# EAGLE design 7120 (EAGLE 8.3.1)
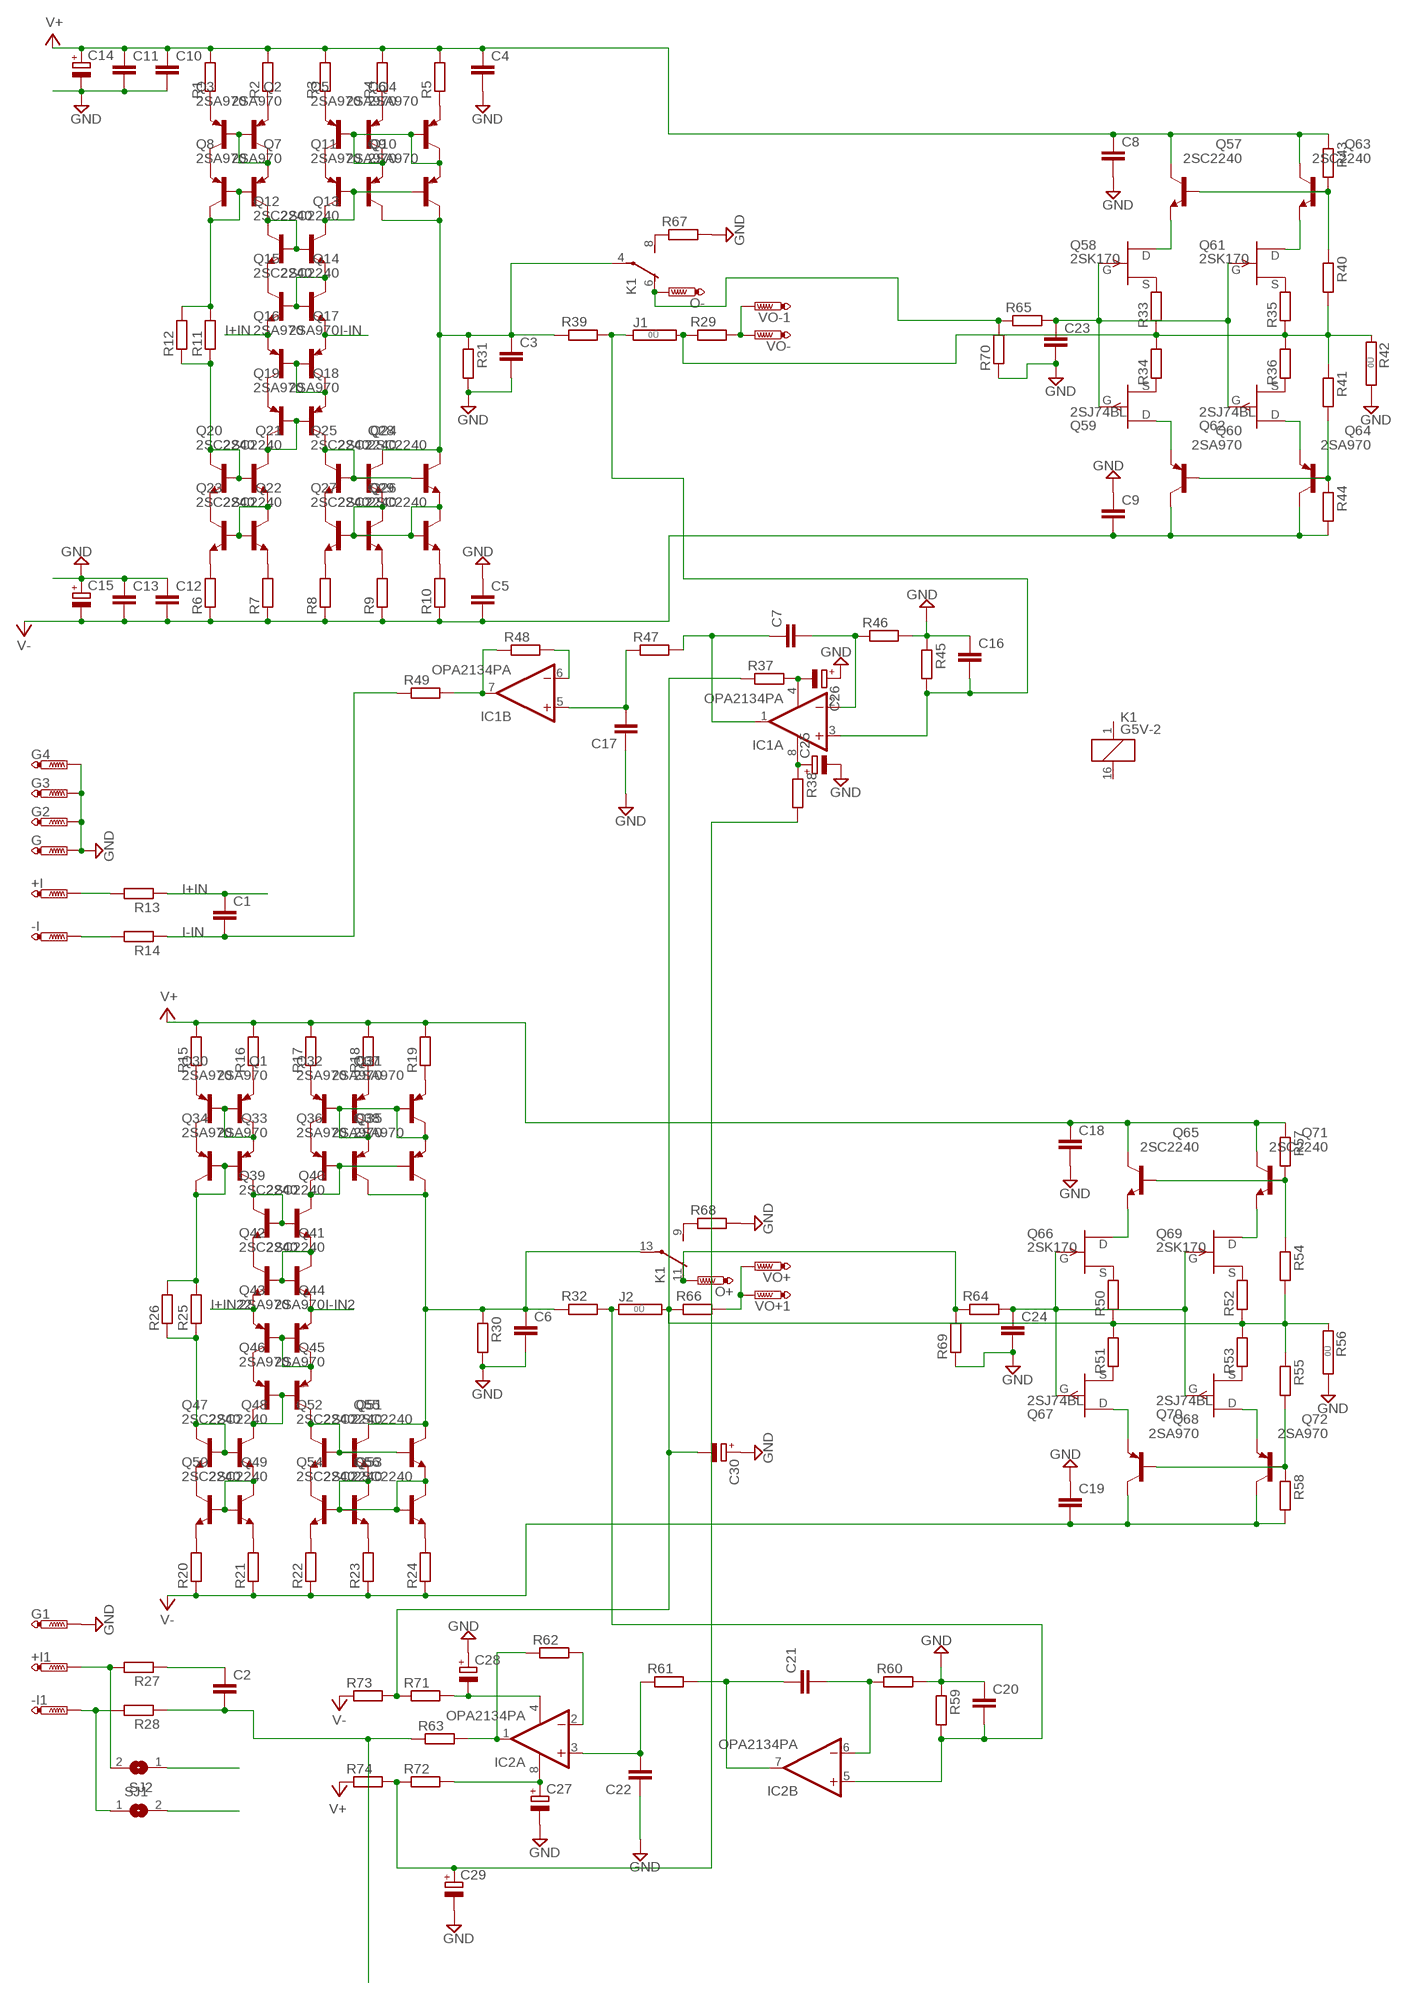
[diagram p0: schematic, sheet 1]

## Parts
+I  PTR1PAD1-20  [P1-20]
+I1  PTR1PAD1-20  [P1-20]
-I  PTR1PAD1-20  [P1-20]
-I1  PTR1PAD1-20  [P1-20]
C1  C-EU050-030X075  [C050-030X075]
C2  C-EU050-030X075  [C050-030X075]
C3  C-EU050-055X075  [C050-055X075]
C4  C-EU050-055X075  [C050-055X075]
C5  C-EU050-055X075  [C050-055X075]
C6  C-EU050-055X075  [C050-055X075]
C7  C-EU050-030X075  [C050-030X075]
C8  C-EU050-055X075  [C050-055X075]
C9  C-EU050-055X075  [C050-055X075]
C10  C-EU050-055X075  [C050-055X075]
C11  C-EU050-055X075  [C050-055X075]
C12  C-EU050-055X075  [C050-055X075]
C13  C-EU050-055X075  [C050-055X075]
C14  CPOL-EUE7.5-18  [E7,5-18]
C15  CPOL-EUE7.5-18  [E7,5-18]
C16  C-EU050-055X075  [C050-055X075]
C17  C-EU050-030X075  [C050-030X075]
C18  C-EU050-055X075  [C050-055X075]
C19  C-EU050-055X075  [C050-055X075]
C20  C-EU050-055X075  [C050-055X075]
C21  C-EU050-030X075  [C050-030X075]
C22  C-EU050-030X075  [C050-030X075]
C23  C-EU050-055X075  [C050-055X075]
C24  C-EU050-055X075  [C050-055X075]
C25  CPOL-EUE2.5-6  [E2,5-6]
C26  CPOL-EUE2.5-6  [E2,5-6]
C27  CPOL-EUE2.5-6  [E2,5-6]
C28  CPOL-EUE2.5-6  [E2,5-6]
C29  CPOL-EUE7.5-18  [E7,5-18]
C30  CPOL-EUE7.5-18  [E7,5-18]
G  PTR1PAD1-20  [P1-20]
G1  PTR1PAD1-20  [P1-20]
G2  PTR1PAD1-20  [P1-20]
G3  PTR1PAD1-20  [P1-20]
G4  PTR1PAD1-20  [P1-20]
IC1  OPA2134PA  [DIL08]
IC2  OPA2134PA  [DIL08]
J1  0R  [0R/10]
J2  0R  [0R/10]
K1  G5V-2  [G5V-2]
O+  PTR1PAD1-20  [P1-20]
O-  PTR1PAD1-20  [P1-20]
Q1  2SA970  [TO92-BCE]
Q2  2SA970  [TO92-BCE]
Q3  2SA970  [TO92-BCE]
Q4  2SA970  [TO92-BCE]
Q5  2SA970  [TO92-BCE]
Q6  2SA970  [TO92-BCE]
Q7  2SA970  [TO92-BCE]
Q8  2SA970  [TO92-BCE]
Q9  2SA970  [TO92-BCE]
Q10  2SA970  [TO92-BCE]
Q11  2SA970  [TO92-BCE]
Q12  2SC2240  [TO92-BCE]
Q13  2SC2240  [TO92-BCE]
Q14  2SC2240  [TO92-BCE]
Q15  2SC2240  [TO92-BCE]
Q16  2SA970  [TO92-BCE]
Q17  2SA970  [TO92-BCE]
Q18  2SA970  [TO92-BCE]
Q19  2SA970  [TO92-BCE]
Q20  2SC2240  [TO92-BCE]
Q21  2SC2240  [TO92-BCE]
Q22  2SC2240  [TO92-BCE]
Q23  2SC2240  [TO92-BCE]
Q24  2SC2240  [TO92-BCE]
Q25  2SC2240  [TO92-BCE]
Q26  2SC2240  [TO92-BCE]
Q27  2SC2240  [TO92-BCE]
Q28  2SC2240  [TO92-BCE]
Q29  2SC2240  [TO92-BCE]
Q30  2SA970  [TO92-BCE]
Q31  2SA970  [TO92-BCE]
Q32  2SA970  [TO92-BCE]
Q33  2SA970  [TO92-BCE]
Q34  2SA970  [TO92-BCE]
Q35  2SA970  [TO92-BCE]
Q36  2SA970  [TO92-BCE]
Q37  2SA970  [TO92-BCE]
Q38  2SA970  [TO92-BCE]
Q39  2SC2240  [TO92-BCE]
Q40  2SC2240  [TO92-BCE]
Q41  2SC2240  [TO92-BCE]
Q42  2SC2240  [TO92-BCE]
Q43  2SA970  [TO92-BCE]
Q44  2SA970  [TO92-BCE]
Q45  2SA970  [TO92-BCE]
Q46  2SA970  [TO92-BCE]
Q47  2SC2240  [TO92-BCE]
Q48  2SC2240  [TO92-BCE]
Q49  2SC2240  [TO92-BCE]
Q50  2SC2240  [TO92-BCE]
Q51  2SC2240  [TO92-BCE]
Q52  2SC2240  [TO92-BCE]
Q53  2SC2240  [TO92-BCE]
Q54  2SC2240  [TO92-BCE]
Q55  2SC2240  [TO92-BCE]
Q56  2SC2240  [TO92-BCE]
Q57  2SC2240  [TO92-BCE]
Q58  2SK170  [TO92-]
Q59  2SJ74BL  [TO92-]
Q60  2SA970  [TO92-BCE]
Q61  2SK170  [TO92-]
Q62  2SJ74BL  [TO92-]
Q63  2SC2240  [TO92-BCE]
Q64  2SA970  [TO92-BCE]
Q65  2SC2240  [TO92-BCE]
Q66  2SK170  [TO92-]
Q67  2SJ74BL  [TO92-]
Q68  2SA970  [TO92-BCE]
Q69  2SK170  [TO92-]
Q70  2SJ74BL  [TO92-]
Q71  2SC2240  [TO92-BCE]
Q72  2SA970  [TO92-BCE]
R1  R-EU_0207/7  [0207/7]
R2  R-EU_0207/7  [0207/7]
R3  R-EU_0207/7  [0207/7]
R4  R-EU_0207/7  [0207/7]
R5  R-EU_0207/7  [0207/7]
R6  R-EU_0207/7  [0207/7]
R7  R-EU_0207/7  [0207/7]
R8  R-EU_0207/7  [0207/7]
R9  R-EU_0207/7  [0207/7]
R10  R-EU_0207/7  [0207/7]
R11  R-EU_0207/7  [0207/7]
R12  R-EU_0207/7  [0207/7]
R13  R-EU_0207/7  [0207/7]
R14  R-EU_0207/7  [0207/7]
R15  R-EU_0207/7  [0207/7]
R16  R-EU_0207/7  [0207/7]
R17  R-EU_0207/7  [0207/7]
R18  R-EU_0207/7  [0207/7]
R19  R-EU_0207/7  [0207/7]
R20  R-EU_0207/7  [0207/7]
R21  R-EU_0207/7  [0207/7]
R22  R-EU_0207/7  [0207/7]
R23  R-EU_0207/7  [0207/7]
R24  R-EU_0207/7  [0207/7]
R25  R-EU_0207/7  [0207/7]
R26  R-EU_0207/7  [0207/7]
R27  R-EU_0207/7  [0207/7]
R28  R-EU_0207/7  [0207/7]
R29  R-EU_0207/7  [0207/7]
R30  R-EU_0207/7  [0207/7]
R31  R-EU_0207/7  [0207/7]
R32  R-EU_0207/7  [0207/7]
R33  R-EU_0207/7  [0207/7]
R34  R-EU_0207/7  [0207/7]
R35  R-EU_0207/7  [0207/7]
R36  R-EU_0207/7  [0207/7]
R37  R-EU_0207/7  [0207/7]
R38  R-EU_0207/7  [0207/7]
R39  R-EU_0207/7  [0207/7]
R40  R-EU_0207/7  [0207/7]
R41  R-EU_0207/7  [0207/7]
R42  0R  [0R/10]
R43  R-EU_0207/7  [0207/7]
R44  R-EU_0207/7  [0207/7]
R45  R-EU_0207/7  [0207/7]
R46  R-EU_0207/7  [0207/7]
R47  R-EU_0207/7  [0207/7]
R48  R-EU_0207/7  [0207/7]
R49  R-EU_0207/7  [0207/7]
R50  R-EU_0207/7  [0207/7]
R51  R-EU_0207/7  [0207/7]
R52  R-EU_0207/7  [0207/7]
R53  R-EU_0207/7  [0207/7]
R54  R-EU_0207/7  [0207/7]
R55  R-EU_0207/7  [0207/7]
R56  0R  [0R/10]
R57  R-EU_0207/7  [0207/7]
R58  R-EU_0207/7  [0207/7]
R59  R-EU_0207/7  [0207/7]
R60  R-EU_0207/7  [0207/7]
R61  R-EU_0207/7  [0207/7]
R62  R-EU_0207/7  [0207/7]
R63  R-EU_0207/7  [0207/7]
R64  R-EU_0207/7  [0207/7]
R65  R-EU_0207/7  [0207/7]
R66  R-EU_0207/7  [0207/7]
R67  R-EU_0207/7  [0207/7]
R68  R-EU_0207/7  [0207/7]
R69  R-EU_0207/7  [0207/7]
R70  R-EU_0207/7  [0207/7]
R71  R-EU_0207/7  [0207/7]
R72  R-EU_0207/7  [0207/7]
R73  R-EU_0207/7  [0207/7]
R74  R-EU_0207/7  [0207/7]
SJ1  SJ  [SJ]
SJ2  SJ  [SJ]
VO+  PTR1PAD1-20  [P1-20]
VO+1  PTR1PAD1-20  [P1-20]
VO-  PTR1PAD1-20  [P1-20]
VO-1  PTR1PAD1-20  [P1-20]

## Nets
+I: +I.TP R13.2 SJ1.2
-I: -I.TP R14.2 SJ2.1
GND: C3.2 C4.2 C5.1 C6.2 C8.2 C9.1 C10.2 C11.2 C12.1 C13.1 C14.- C15.+ C16.1 C17.1 C18.2 C19.1 C20.1 C22.1 C23.2 C24.2 C25.- C26.+ C27.- C28.+ C29.- C30.+ G1.TP G2.TP G3.TP G4.TP G.TP R30.2 R31.2 R42.2 R45.1 R46.2 R56.2 R59.1 R60.2 R67.2 R68.2 R69.1 R70.1
I+IN: C1.1 Q14.E Q17.E R13.1
I+IN2: C2.1 R27.1
I+IN22: Q41.E Q44.E
I-IN: C1.2 Q15.E Q16.E R14.1 R49.1
I-IN1: C2.2 R28.1 R63.1
I-IN2: Q42.E Q43.E
N$1: Q2.E R1.1
N$2: Q2.B Q3.B Q3.C Q8.E
N$3: Q3.E R2.1
N$4: Q2.C Q7.E
N$5: Q7.B Q7.C Q8.B R11.2 R12.2
N$6: Q4.E R3.1
N$7: Q4.B Q5.B Q5.C Q6.B Q6.C Q9.E Q11.E
N$8: Q5.E R4.1
N$9: Q6.E R5.1
N$10: Q8.C Q12.B Q13.B Q13.C
N$11: C3.1 K1.4(1:P) Q9.C Q11.C Q25.C Q28.C R31.1 R39.1
N$12: Q4.C Q10.E
N$13: Q12.E Q14.B Q15.B Q15.C
N$14: Q9.B Q10.B Q10.C Q11.B Q12.C
N$15: C16.2 IC1.3(A:+IN) J1.1 R39.2 R45.2
N$16: Q13.E Q14.C
N$17: C6.1 K1.13(2:P) Q36.C Q38.C Q52.C Q55.C R30.1 R32.1
N$18: Q57.B Q63.B R40.1 R43.2
N$19: Q1.E R15.1
N$20: Q16.B Q16.C Q17.B Q19.E
N$21: Q17.C Q18.E
N$22: Q1.B Q30.B Q30.C Q34.E
N$23: Q18.B Q18.C Q19.B Q20.C
N$24: Q30.E R16.1
N$25: Q20.B Q21.B Q21.C R11.1 R12.1
N$26: Q21.E Q22.C
N$27: Q20.E Q22.B Q23.B Q23.C
N$28: Q33.B Q33.C Q34.B R25.2 R26.2
N$29: Q19.C Q24.B Q24.C Q25.B Q28.B
N$30: Q1.C Q33.E
N$31: Q24.E Q26.C
N$32: Q25.E Q26.B Q27.B Q27.C Q28.E Q29.B Q29.C
N$33: Q31.E R17.1
N$34: Q31.B Q32.B Q32.C Q36.E Q37.B Q37.C Q38.E
N$35: Q32.E R18.1
N$36: Q22.E R6.2
N$37: Q23.E R7.2
N$38: Q26.E R8.2
N$39: Q27.E R9.2
N$40: Q29.E R10.2
N$41: J1.2 R29.1 R33.1 R34.2 R35.1 R36.2 R40.2 R41.1 R42.1
N$42: Q31.C Q35.E
N$43: Q35.B Q35.C Q36.B Q38.B Q39.C
N$44: K1.6(1:O) O-.TP R65.1 R70.2
N$45: Q37.E R19.1
N$46: Q60.B Q64.B R41.2 R44.1
N$47: Q34.C Q39.B Q40.B Q40.C
N$48: Q40.E Q41.C
N$49: Q39.E Q41.B Q42.B Q42.C
N$50: Q43.B Q43.C Q44.B Q46.E
N$51: Q44.C Q45.E
N$52: Q45.B Q45.C Q46.B Q47.C
N$53: Q47.B Q48.B Q48.C R25.1 R26.1
N$54: Q48.E Q49.C
N$55: Q47.E Q49.B Q50.B Q50.C
N$56: Q46.C Q51.B Q51.C Q52.B Q55.B
N$57: Q51.E Q53.C
N$58: Q49.E R20.2
N$59: Q50.E R21.2
N$60: Q53.E R22.2
N$61: Q54.E R23.2
N$62: Q56.E R24.2
N$63: C7.1 IC1.1(A:OUT) R47.2
N$64: Q52.E Q53.B Q54.B Q54.C Q55.E Q56.B Q56.C
N$65: +I1.TP R27.2 SJ2.2
N$66: -I1.TP R28.2 SJ1.1
N$67: Q62.3(S) R36.1
N$68: Q59.3(S) R34.1
N$69: K1.8(1:S) R67.1
N$70: Q58.3(S) R33.2
N$71: Q61.3(S) R35.2
N$72: C7.2 IC1.2(A:-IN) R46.1
N$73: C23.1 Q58.2(G) Q59.2(G) Q61.2(G) Q62.2(G) R65.2
N$74: Q61.1(D) Q63.E
N$75: C17.2 IC1.5(B:+IN) R47.1
N$76: Q57.E Q58.1(D)
N$77: Q62.1(D) Q64.E
N$78: Q59.1(D) Q60.E
N$79: IC1.7(B:OUT) R48.1 R49.2
N$80: IC1.6(B:-IN) R48.2
N$81: Q65.B Q71.B R54.1 R57.2
N$82: Q68.B Q72.B R55.2 R58.1
N$83: J2.2 R50.1 R51.2 R52.1 R53.2 R54.2 R55.1 R56.1 R66.1
N$84: C24.1 Q66.2(G) Q67.2(G) Q69.2(G) Q70.2(G) R64.2
N$85: Q70.3(S) R53.1
N$86: Q67.3(S) R51.1
N$87: Q69.1(D) Q71.E
N$88: Q70.1(D) Q72.E
N$89: Q67.1(D) Q68.E
N$90: Q69.3(S) R52.2
N$91: Q66.3(S) R50.2
N$92: Q65.E Q66.1(D)
N$93: C21.1 IC2.7(B:OUT) R61.2
N$94: C21.2 IC2.6(B:-IN) R60.1
N$95: C20.2 IC2.5(B:+IN) J2.1 R32.2 R59.2
N$96: K1.9(2:S) R68.1
N$97: C22.2 IC2.3(A:+IN) R61.1
N$98: IC2.1(A:OUT) R62.1 R63.2
N$99: IC2.2(A:-IN) R62.2
N$101: R66.2 VO+1.TP VO+.TP
N$102: K1.11(2:O) O+.TP R64.1 R69.2
N$103: R29.2 VO-1.TP VO-.TP
N$105: C28.- IC2.4(A:V-) R71.2
N$106: C27.+ IC2.8(A:V+) R72.2
N$107: C25.+ IC1.8(A:V+) R38.1
N$108: C26.- IC1.4(A:V-) R37.2
N$109: C30.- R37.1 R71.1 R73.2
N$110: C29.+ R38.2 R72.1 R74.2
V+: C4.1 C8.1 C10.1 C11.1 C14.+ C18.1 Q57.C Q63.C Q65.C Q71.C R1.2 R2.2 R3.2 R4.2 R5.2 R15.2 R16.2 R17.2 R18.2 R19.2 R43.1 R57.1 R74.1
V-: C5.2 C9.2 C12.2 C13.2 C15.- C19.2 Q60.C Q64.C Q68.C Q72.C R6.1 R7.1 R8.1 R9.1 R10.1 R20.1 R21.1 R22.1 R23.1 R24.1 R44.2 R58.2 R73.1
Unconnected: K1.1 K1.16

## Library data of the parts
+I +I1 -I -I1 G G1-G4 O+ O- VO+ VO+1 VO- VO-1 = testpad:PTR1: TEST PIN
C1-C13 C16-C24 = Vwvwbg:C-EU: CAPACITOR, European symbol
C14 C15 C25-C30 = Vwvwbg:CPOL-EU: POLARIZED CAPACITOR, European symbol
IC1 IC2 = linear:OPA2*: Dual Operational Amplifier Low Power, Single-Supply, Rail-To-Rail Operational Amplifier Source: http://focus.ti.com/lit/ds/symlink/opa2345.pdf http://focus.ti.com .. opa241.pdf http://focus.ti.com/lit/ds/symlink/opa2134.pdf
J1 J2 R42 R56 = jumper:0R: Bridge 0R 10mm
K1 = relay:G5V-2: OMRON PCB Relay Source: http://www.omron.com/ecb/products/pdf/en-g5v2.pdf; MPN: G5V-2 5DC; OC_FARNELL: 9949488; OC_NEWARK: 78K5703
Q1-Q11 Q16-Q19 Q30-Q38 Q43-Q46 Q60 Q64 Q68 Q72 = tranzistory PNP:2SA970: PNP Transistor
Q12-Q15 Q20-Q29 Q39-Q42 Q47-Q57 Q63 Q65 Q71 = tranzistory NPN:2SC2240: NPN Transistor
Q58 Q61 Q66 Q69 = tranzistory FET:2SK170: N-Channel Junction FET
Q59 Q62 Q67 Q70 = tranzistory FET:2SJ74BL
R1-R41 R43-R55 R57-R74 = Vwvwbg:R-EU_: RESISTOR, European symbol
SJ1 SJ2 = jumper:SJ: SMD solder JUMPER

## Board
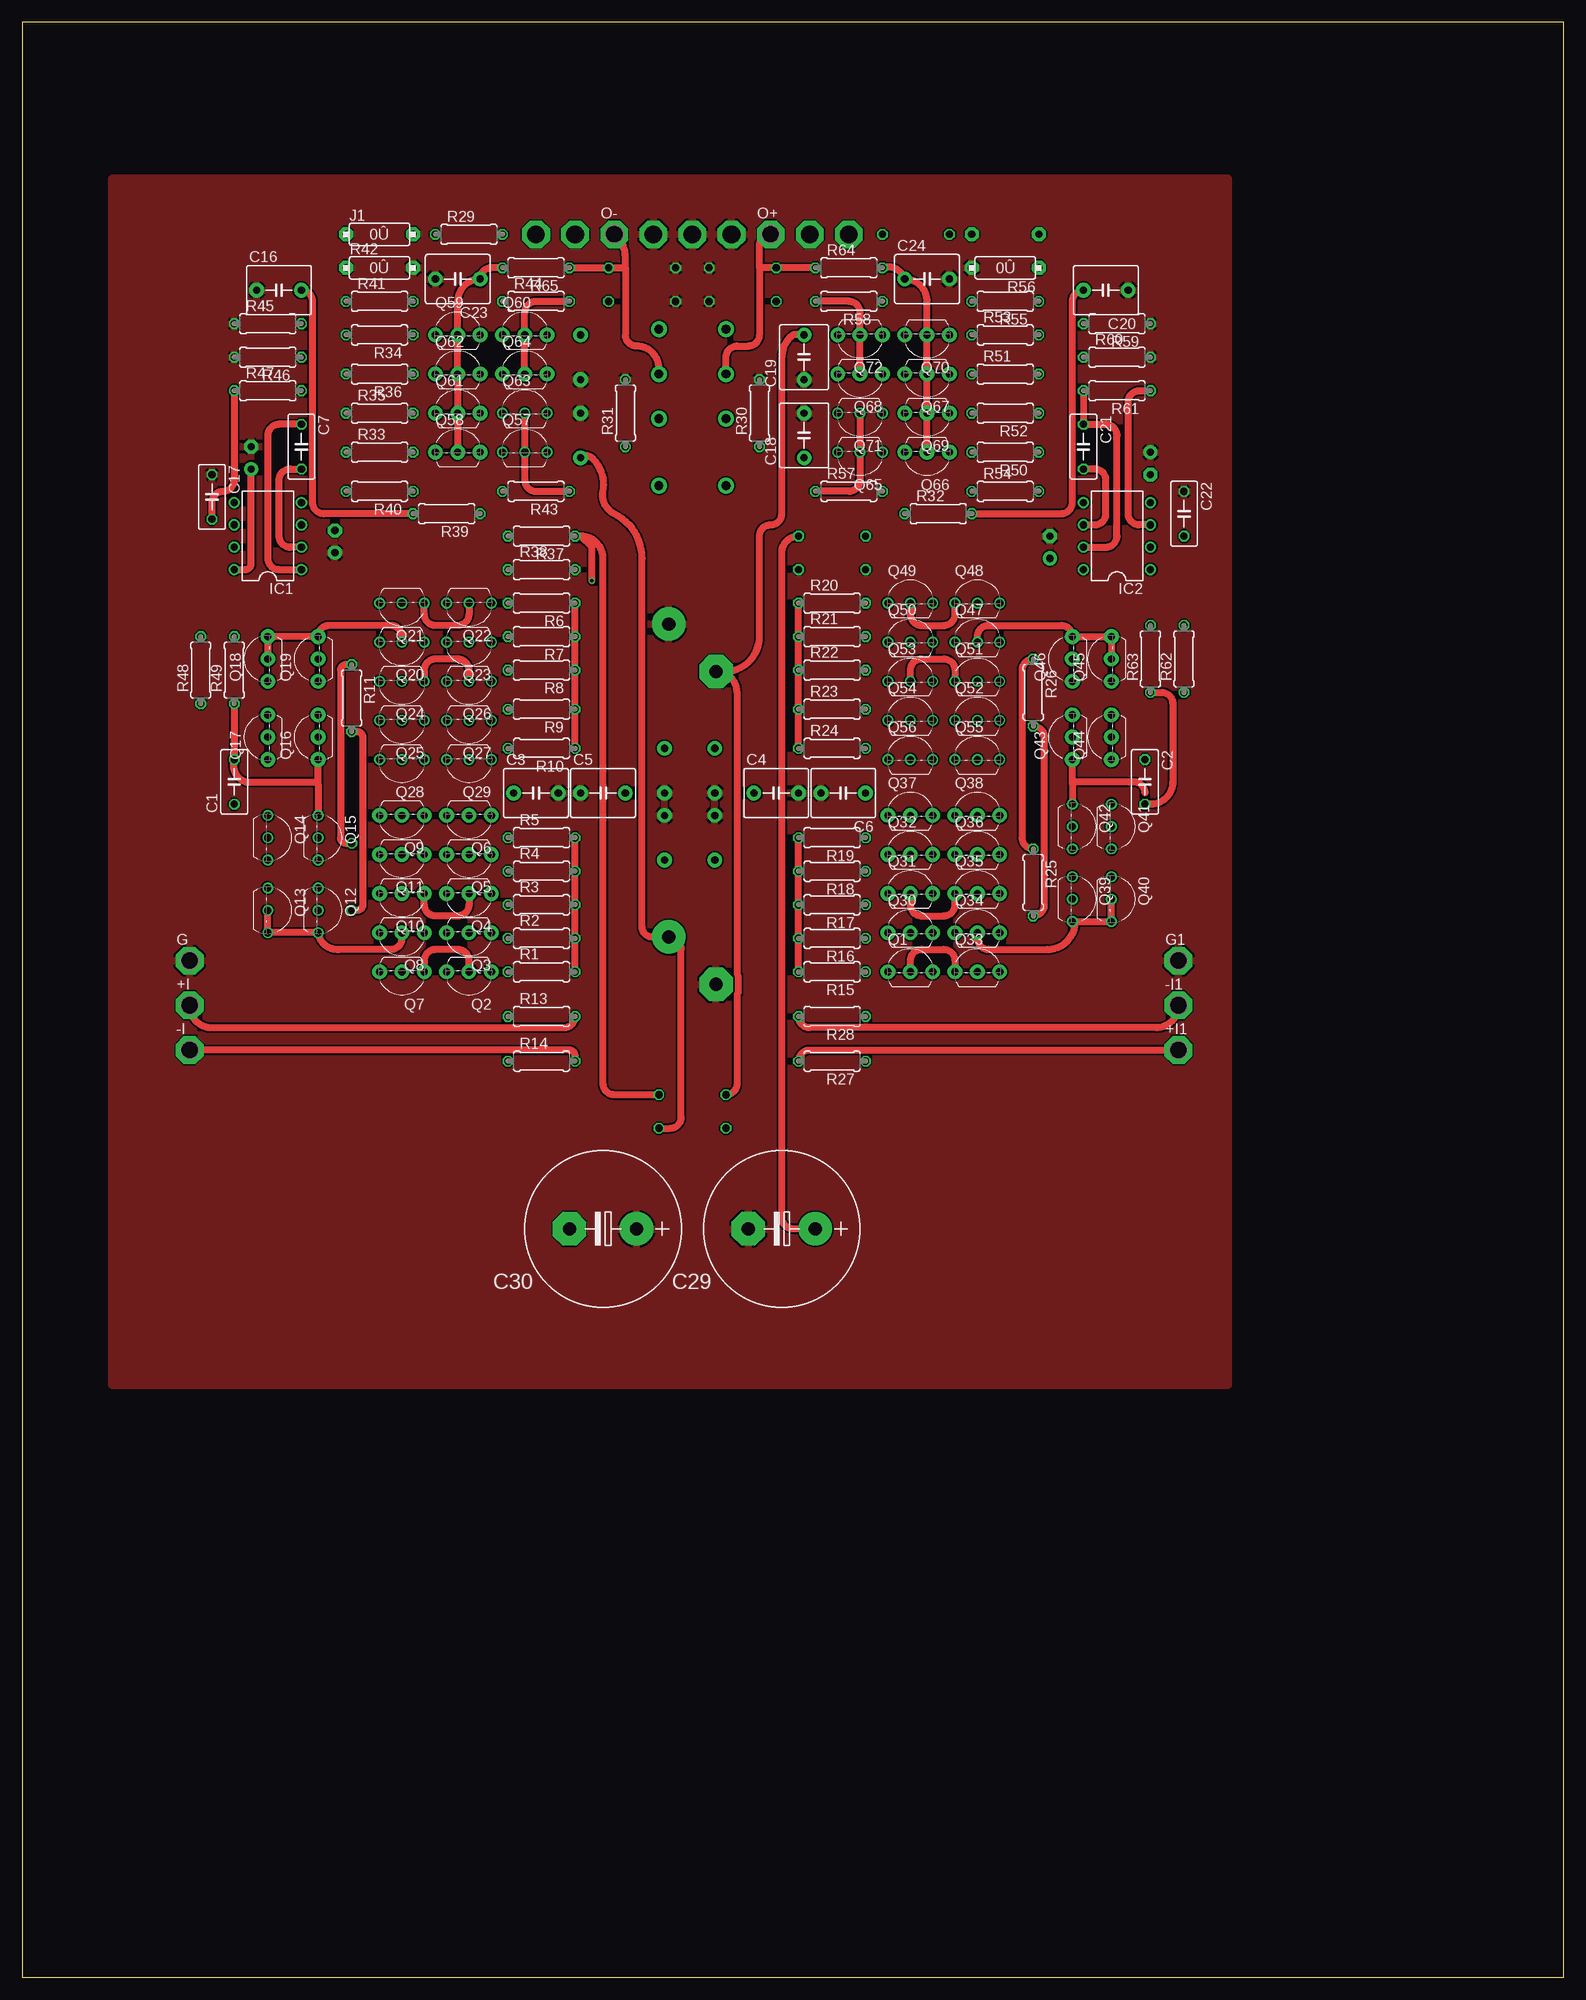
[diagram p1: board, top side]
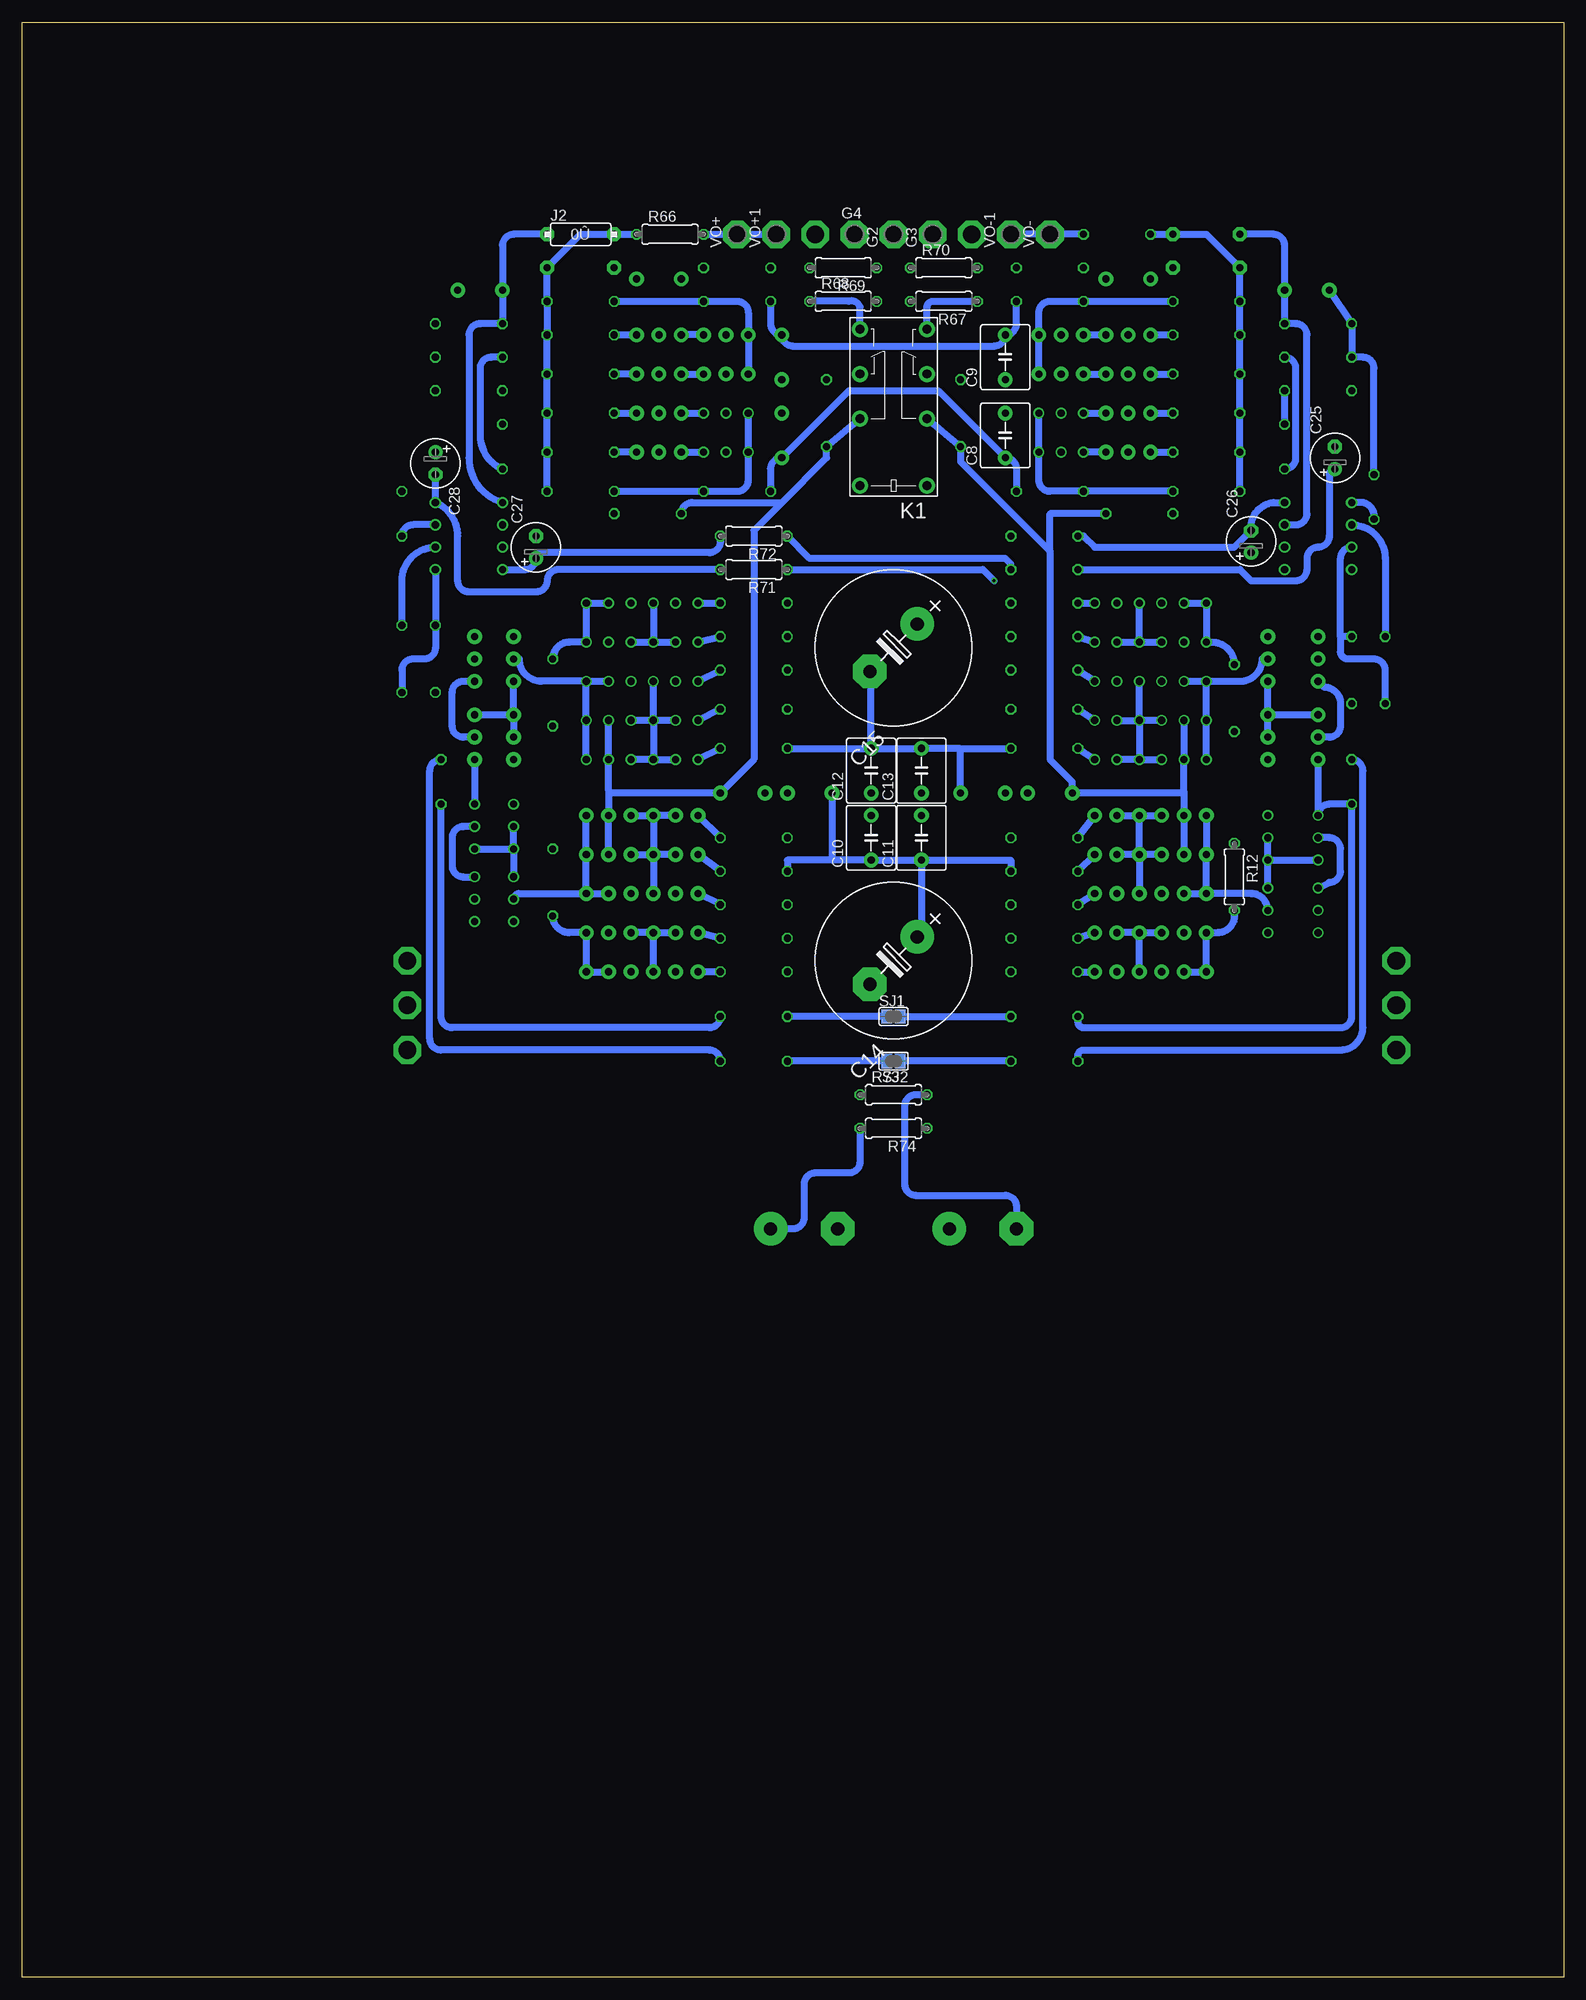
[diagram p2: board, bottom side, seen from below]

Size 175.26 x 222.25 mm. Coordinates in mm from the lower left corner, seen from the top.
Outline: 0,0 175.26,0 175.26,222.25 0,222.25 0,0
Copper layers (1*16): Top 0.035mm / dielectric 1.5mm / Bottom 0.035mm
Design rules "default": minimum track width 6mil, minimum drill 0.3mm, track to track 7mil, track to pad 7mil, pad to pad 7mil, via to via 7mil, smd to smd 7mil, copper to edge 8mil, drill to drill 8mil, minimum pad ring 6mil, minimum via ring 6mil, stop-mask expansion 4mil, vias tented up to drill 0mil, thermal gap 10mil

### Footprints (pad centres in the part's own frame; a part is rotated, then mirrored left to right if it is on the bottom)
P1-20 = drill 2.007 pad 3.15 octagon: TP 0,0
C050-030X075 = drill 0.813 octagon: 1 -2.54,0; 2 2.54,0
C050-055X075 = drill 0.813 pad 1.676: 1 -2.54,0; 2 2.54,0
E7,5-18 = drill 1.5 pad 3.81: + -3.81,0 | drill 1.5 pad 3.81 octagon: - 3.81,0
E2,5-6 = drill 0.813 pad 1.6: + -1.27,0 | drill 0.813 pad 1.6 octagon: - 1.27,0
DIL08 = drill 0.813 pad 1.27: 1 -3.81,-3.81; 2 -1.27,-3.81; 3 1.27,-3.81; 4 3.81,-3.81; 5 3.81,3.81; 6 1.27,3.81; 7 -1.27,3.81; 8 -3.81,3.81
0R/10 = drill 0.813 pad 1.6 octagon: 1 -3.81,0; 2 3.81,0
G5V-2 = drill 1 pad 1.8: 1 -8.89,-3.81; 4 -1.27,-3.81; 6 3.81,-3.81; 8 8.89,-3.81; 9 8.89,3.81; 11 3.81,3.81; 13 -1.27,3.81; 16 -8.89,3.81
TO92-BCE = drill 0.813 pad 1.676: B 2.54,0; C 0,0; E -2.54,0
TO92-BCE' = drill 0.813: B 2.54,0; C 0,0; E -2.54,0
TO92- = drill 0.813 pad 1.676: 1 2.54,0; 2 0,0; 3 -2.54,0
0207/7 = drill 0.813 octagon: 1 -3.81,0; 2 3.81,0
SJ = smd 1.168 x 1.6: 1 -0.762,0; 2 0.762,0

### Placement (x,y rotation side)
+I  19.05,110.49 0 top
+I1  131.44,105.41 0 top
-I  19.05,105.41 0 top
-I1  131.44,110.49 0 top
C1  24.13,135.89 90 top
C2  127.64,135.89 270 top
C3  58.42,134.62 0 top
C4  85.72,134.62 0 top
C5  66.04,134.62 0 top
C6  93.34,134.62 180 top
C7  31.75,173.99 270 top
C8  63.5,175.26 90 bottom
C9  63.5,184.15 90 bottom
C10  78.74,129.54 90 bottom
C11  73.03,129.54 90 bottom
C12  78.74,137.16 90 bottom
C13  73.03,137.16 90 bottom
C14  76.2,115.57 225 bottom
C15  76.2,151.13 225 bottom
C16  29.21,191.77 0 top
C17  21.59,168.28 270 top
C18  88.9,175.26 90 top
C19  88.9,184.15 90 top
C20  123.19,191.77 180 top
C21  120.65,173.99 270 top
C22  132.08,166.37 270 top
C23  49.53,193.04 180 top
C24  102.87,193.04 0 top
C25  26.04,172.72 90 bottom
C26  35.56,163.19 90 bottom
C27  116.84,162.56 90 bottom
C28  128.27,172.09 270 bottom
C29  86.36,85.09 180 top
C30  66.04,85.09 180 top
G  19.05,115.57 0 top
G1  131.44,115.57 0 top
G2  76.2,198.12 90 bottom
G3  71.75,198.12 90 bottom
G4  80.64,198.12 0 bottom
IC1  27.94,163.83 90 top
IC2  124.46,163.83 90 top
J1  40.64,198.12 0 top
J2  111.76,198.12 0 bottom
K1  76.2,178.44 90 bottom
O+  85.09,198.12 0 top
O-  67.31,198.12 0 top
Q1  100.97,114.3 0 top
Q2  50.8,114.3 180 top
Q3  50.8,118.75 180 top
Q4  50.8,123.19 180 top
Q5  50.8,127.64 180 top
Q6  50.8,132.08 180 top
Q7  43.18,114.3 180 top
Q8  43.18,118.75 180 top
Q9  43.18,132.08 180 top
Q10  43.18,123.19 180 top
Q11  43.18,127.64 180 top
Q12  2SC2240  [TO92-BCE']  33.66,121.28 270 top
Q13  2SC2240  [TO92-BCE']  27.94,121.28 270 top
Q14  2SC2240  [TO92-BCE']  27.94,129.54 270 top
Q15  2SC2240  [TO92-BCE']  33.66,129.54 270 top
Q16  33.66,140.97 90 top
Q17  27.94,140.97 90 top
Q18  27.94,149.86 90 top
Q19  33.66,149.86 90 top
Q20  2SC2240  [TO92-BCE']  43.18,151.76 180 top
Q21  2SC2240  [TO92-BCE']  43.18,156.21 180 top
Q22  2SC2240  [TO92-BCE']  50.8,156.21 180 top
Q23  2SC2240  [TO92-BCE']  50.8,151.76 180 top
Q24  2SC2240  [TO92-BCE']  43.18,147.32 180 top
Q25  2SC2240  [TO92-BCE']  43.18,142.88 180 top
Q26  2SC2240  [TO92-BCE']  50.8,147.32 180 top
Q27  2SC2240  [TO92-BCE']  50.8,142.88 180 top
Q28  2SC2240  [TO92-BCE']  43.18,138.43 180 top
Q29  2SC2240  [TO92-BCE']  50.8,138.43 180 top
Q30  100.97,118.75 0 top
Q31  100.97,123.19 0 top
Q32  100.97,127.64 0 top
Q33  108.58,114.3 0 top
Q34  108.58,118.75 0 top
Q35  108.58,123.19 0 top
Q36  108.58,127.64 0 top
Q37  100.97,132.08 0 top
Q38  108.58,132.08 0 top
Q39  2SC2240  [TO92-BCE']  119.38,122.56 270 top
Q40  2SC2240  [TO92-BCE']  123.83,122.56 270 top
Q41  2SC2240  [TO92-BCE']  123.83,130.81 270 top
Q42  2SC2240  [TO92-BCE']  119.38,130.81 270 top
Q43  119.38,140.97 90 top
Q44  123.83,140.97 90 top
Q45  123.83,149.86 90 top
Q46  119.38,149.86 90 top
Q47  2SC2240  [TO92-BCE']  108.58,151.76 0 top
Q48  2SC2240  [TO92-BCE']  108.58,156.21 0 top
Q49  2SC2240  [TO92-BCE']  100.97,156.21 0 top
Q50  2SC2240  [TO92-BCE']  100.97,151.76 0 top
Q51  2SC2240  [TO92-BCE']  108.58,147.32 0 top
Q52  2SC2240  [TO92-BCE']  108.58,142.88 0 top
Q53  2SC2240  [TO92-BCE']  100.97,147.32 0 top
Q54  2SC2240  [TO92-BCE']  100.97,142.88 0 top
Q55  2SC2240  [TO92-BCE']  108.58,138.43 0 top
Q56  2SC2240  [TO92-BCE']  100.97,138.43 0 top
Q57  2SC2240  [TO92-BCE']  57.15,173.35 0 top
Q58  49.53,173.35 0 top
Q59  49.53,186.69 0 top
Q60  57.15,186.69 0 top
Q61  49.53,177.8 0 top
Q62  49.53,182.25 0 top
Q63  2SC2240  [TO92-BCE']  57.15,177.8 0 top
Q64  57.15,182.25 0 top
Q65  2SC2240  [TO92-BCE']  95.25,173.35 180 top
Q66  102.87,173.35 180 top
Q67  102.87,182.25 180 top
Q68  95.25,182.25 180 top
Q69  102.87,177.8 180 top
Q70  102.87,186.69 180 top
Q71  2SC2240  [TO92-BCE']  95.25,177.8 180 top
Q72  95.25,186.69 180 top
R1  59.05,114.3 0 top
R2  59.05,118.11 0 top
R3  59.05,121.92 0 top
R4  59.05,125.73 0 top
R5  59.05,129.54 0 top
R6  59.05,156.21 180 top
R7  59.05,152.4 180 top
R8  59.05,148.59 180 top
R9  59.05,144.15 180 top
R10  59.05,139.7 180 top
R11  37.47,145.41 270 top
R12  37.47,125.09 270 bottom
R13  59.05,109.22 0 top
R14  59.05,104.14 0 top
R15  92.08,114.3 180 top
R16  92.08,118.11 180 top
R17  92.08,121.92 180 top
R18  92.08,125.73 180 top
R19  92.08,129.54 180 top
R20  92.08,156.21 0 top
R21  92.08,152.4 0 top
R22  92.08,148.59 0 top
R23  92.08,144.15 0 top
R24  92.08,139.7 0 top
R25  114.94,124.46 270 top
R26  114.94,146.05 270 top
R27  92.08,104.14 180 top
R28  92.08,109.22 180 top
R29  50.8,198.12 0 top
R30  83.82,177.8 90 top
R31  68.58,177.8 90 top
R32  104.14,166.37 0 top
R33  40.64,173.35 0 top
R34  40.64,186.69 180 top
R35  40.64,177.8 0 top
R36  40.64,182.25 180 top
R37  59.05,163.83 180 top
R38  59.05,160.02 0 top
R39  48.26,166.37 180 top
R40  40.64,168.91 180 top
R41  40.64,190.5 0 top
R42  40.64,194.31 0 top
R43  58.42,168.91 180 top
R44  58.42,190.5 0 top
R45  27.94,187.96 0 top
R46  27.94,184.15 180 top
R47  27.94,180.34 0 top
R48  20.32,148.59 90 top
R49  24.13,148.59 90 top
R50  111.76,173.35 180 top
R51  111.76,182.25 0 top
R52  111.76,177.8 180 top
R53  111.76,186.69 0 top
R54  111.76,168.91 0 top
R55  111.76,190.5 180 top
R56  111.76,194.31 180 top
R57  93.98,168.91 0 top
R58  93.98,190.5 180 top
R59  124.46,187.96 180 top
R60  124.46,184.15 0 top
R61  124.46,180.34 180 top
R62  132.08,149.86 90 top
R63  128.27,149.86 90 top
R64  93.98,194.31 0 top
R65  58.42,194.31 180 top
R66  101.6,198.12 0 bottom
R67  70.48,190.5 180 bottom
R68  81.92,190.5 0 bottom
R69  81.92,194.31 180 bottom
R70  70.48,194.31 0 bottom
R71  92.08,160.02 180 bottom
R72  92.08,163.83 180 bottom
R73  76.2,100.33 0 bottom
R74  76.2,96.52 180 bottom
SJ1  76.2,109.22 0 bottom
SJ2  76.2,104.14 180 bottom
VO+  93.98,198.12 90 bottom
VO+1  89.53,198.12 90 bottom
VO-  58.42,198.12 90 bottom
VO-1  62.87,198.12 90 bottom

### Tracks (layer width: path | path; a pad name or v marks a point on that pad's centre or on a via)
+I
  Top 0.813: +I.TP arc90 21.59,107.95 61.59,107.95 arc90 R13.2
  Bottom 0.813: SJ1.2 R13.2
-I
  Top 0.813: R14.2 62.87,104.78 arc90 62.23,105.41 -I.TP
  Bottom 0.813: R14.2 SJ2.1
GND
  Bottom 0.813: 24.13,184.2 R45.1 C16.1 | 24.13,184.2 R46.2 | C17.1 21.59,182.88 arc-90 22.86,184.15 24.08,184.15 arc90 24.13,184.2
  pour Top: 137.16,204.47 10.16,204.47 10.16,67.31 137.16,67.31
I+IN
  Bottom 0.813: Q17.E Q14.E arc90 26.67,133.35 C1.1 24.13,109.22 arc90 25.4,107.95 54.61,107.95 arc90 55.24,108.58 R13.1
I+IN2
  Bottom 0.813: R27.1 arc-90 97.16,105.41 127.64,105.41 arc90 128.91,106.68 128.91,137.16 arc90 C2.1
I+IN22
  Bottom 0.813: Q44.E Q41.E
I-IN
  Top 0.813: 33.66,135.56 Q16.E | 33.66,135.56 Q15.E | 33.66,135.56 arc90 33.32,135.89 25.4,135.89 arc-90 C1.2 R49.1
  Bottom 0.813: R14.1 55.24,104.78 arc90 54.61,105.41 25.4,105.41 arc-90 22.86,107.95 22.86,137.16 arc-90 C1.2
I-IN1
  Top 0.813: R63.1 129.54,146.05 arc-90 130.81,144.78 130.81,135.89 arc-90 128.27,133.35 C2.2
  Bottom 0.813: R28.1 arc90 97.16,107.95 126.36,107.95 arc90 127.64,109.22 C2.2
I-IN2
  Top 0.813: 119.38,135.72 Q43.E | 119.38,135.72 Q42.E | 127.64,134.62 arc90 126.36,135.89 119.55,135.89 arc90 119.38,135.72
N$1
  Bottom 0.813: R1.1 Q2.E
N$2
  Bottom 0.813: 48.37,118.75 Q3.C | 48.37,118.75 Q3.B Q8.E | Q2.B 48.26,118.64 arc-90 48.37,118.75
N$3
  Bottom 0.813: Q3.E R2.1
N$4
  Top 0.813: Q2.C 50.8,115.57 arc90 49.53,116.84 46.99,116.84 arc90 45.72,115.57 Q7.E
N$5
  Top 0.813: R11.2 38.1,141.6 arc-90 38.73,140.97 38.73,121.92 arc-90 38.1,121.28 R12.2
  Bottom 0.813: R12.2 37.47,120.65 arc90 39.37,118.75 40.19,118.75 | 40.19,118.75 Q8.B | 40.19,118.75 arc-90 40.64,118.29 Q7.B Q7.C
N$6
  Bottom 0.813: Q4.E R3.1
N$7
  Bottom 0.813: Q6.B Q9.E | 48.26,127.72 Q6.B | 48.26,127.72 Q5.B | Q5.B Q4.B | Q11.E 48.17,127.64 arc90 48.26,127.72 | Q5.B Q5.C | Q6.C Q6.B
N$8
  Bottom 0.813: Q5.E R4.1
N$9
  Bottom 0.813: R5.1 Q6.E
N$10
  Top 0.813: Q8.C 43.18,118.11 arc-90 41.91,116.84 36.2,116.84 arc-90 Q12.B Q13.B Q13.C
N$11
  Bottom 0.813: Q11.C Q9.C 43.18,134.76 | Q25.C Q28.C 43.18,134.76 | 43.18,134.76 arc90 43.32,134.62 C3.1 55.88,135.89 58.42,138.43 58.42,162.11 | 58.42,162.11 58.42,166.37 R39.1 | K1.4 R31.1 68.58,172.27 58.42,162.11
N$12
  Top 0.813: Q4.C 50.8,121.92 arc-90 49.53,120.65 46.99,120.65 arc-90 45.72,121.92 Q10.E
N$13
  Bottom 0.813: Q15.B Q14.B | Q15.B Q15.C | Q12.E Q15.B
N$14
  Bottom 0.813: Q9.B Q11.B 40.64,123.34 | 40.64,123.34 Q10.B 35.56,123.19 arc90 Q12.C | Q10.C 40.79,123.19 arc-90 40.64,123.34
N$15
  Top 0.813: R39.2 34.29,166.37 arc-90 33.02,167.64 33.02,190.5 arc90 C16.2
  Bottom 0.813: IC1.3 30.48,165.1 arc-90 29.21,166.37 29.21,186.69 arc-90 30.48,187.96 R45.2 C16.2 31.75,196.85 arc-90 33.02,198.12 J1.1
N$16
  Bottom 0.813: Q13.E 26.67,124.46 arc-90 25.4,125.73 25.4,128.27 arc-90 26.67,129.54 Q14.C
N$17
  Bottom 0.813: Q36.C Q38.C 108.58,134.91 | 108.58,134.91 Q55.C Q52.C | K1.13 R30.1 83.82,172.72 88.9,167.64 | R32.1 arc90 99.06,167.64 88.9,167.64 | 88.9,167.64 92.08,164.47 92.08,138.43 C6.1 108.3,134.62 108.58,134.91
N$18
  Bottom 0.813: R40.1 R43.2 58.42,168.91 arc90 59.69,170.18 Q57.B Q63.B
N$19
  Bottom 0.813: R15.1 Q1.E
N$20
  Bottom 0.813: Q16.B Q19.E | Q16.B Q17.B | Q16.C Q16.B
N$21
  Bottom 0.813: Q18.E 27.3,146.69 arc90 25.4,144.78 25.4,142.24 arc90 26.67,140.97 Q17.C
N$22
  Bottom 0.813: 103.64,118.75 Q34.E | 103.64,118.75 Q30.B Q30.C | Q1.B 103.5,118.61 arc-90 103.64,118.75
N$23
  Top 0.813: Q18.C Q18.B Q19.B arc-90 34.92,153.67 41.91,153.67 arc-90 43.18,152.4 Q20.C
N$24
  Bottom 0.813: R16.1 Q30.E
N$25
  Top 0.813: R11.1 36.83,149.22 arc90 36.2,148.59 36.2,129.54 arc90 36.83,128.91 R12.1
  Bottom 0.813: Q21.C Q21.B Q20.B 40.01,151.76 arc90 R11.1
N$26
  Top 0.813: Q22.C 50.8,154.94 arc-90 49.53,153.67 46.99,153.67 arc-90 45.72,154.94 Q21.E
N$27
  Bottom 0.813: 48.26,151.85 Q22.B | 48.26,151.85 Q23.B Q20.E | Q23.C 48.35,151.76 arc-90 48.26,151.85
N$28
  Top 0.813: R26.2 arc-90 116.2,140.97 116.2,121.92 arc-90 R25.2
  Bottom 0.813: R25.2 arc-90 113.03,118.75 Q34.B Q33.B Q33.C
N$29
  Bottom 0.813: Q24.C Q24.B | Q24.B Q25.B Q28.B | Q24.B 36.83,147.32 arc-90 34.29,149.86 Q19.C
N$30
  Top 0.813: Q1.C 100.97,115.57 arc-90 102.23,116.84 104.78,116.84 arc-90 106.05,115.57 Q33.E
N$31
  Top 0.813: Q26.C 50.8,148.59 arc90 49.53,149.86 46.99,149.86 arc90 45.72,148.59 Q24.E
N$32
  Bottom 0.813: 48.43,138.43 Q29.C | 48.43,138.43 Q29.B Q28.E | Q27.B Q26.B | Q27.B 48.26,138.6 arc90 48.43,138.43 | Q25.E Q27.B | Q27.C Q27.B
N$33
  Bottom 0.813: R17.1 Q31.E
N$34
  Bottom 0.813: 103.5,127.16 Q32.B | 103.5,127.16 Q31.B | 103.5,131.94 Q32.B | 103.5,131.94 Q37.B Q37.C | Q38.E 103.65,132.08 arc90 103.5,131.94 | Q32.C Q32.B | Q36.E 103.98,127.64 arc90 103.5,127.16
N$35
  Bottom 0.813: R18.1 Q32.E
N$36
  Bottom 0.813: R6.2 Q22.E
N$37
  Bottom 0.813: R7.2 Q23.E
N$38
  Bottom 0.813: R8.2 Q26.E
N$39
  Bottom 0.813: R9.2 Q27.E
N$40
  Bottom 0.813: R10.2 Q29.E
N$41
  Bottom 0.813: R40.2 R33.1 R35.1 R36.2 R34.2 R41.1 R42.1 40.64,198.12 J1.2 R29.1
N$42
  Top 0.813: Q31.C 100.97,121.92 arc90 102.23,120.65 104.78,120.65 arc90 106.05,121.92 Q35.E
N$43
  Bottom 0.813: Q35.B 118.75,123.19 arc-90 Q39.C | Q35.B Q35.C | Q35.B Q36.B Q38.B
N$44
  Top 0.813: K1.6 72.39,182.88 arc90 69.85,185.42 arc-90 68.58,186.69 68.58,194.31 | 68.58,194.31 68.58,195.58 arc53 O-.TP | R65.1 R70.2 68.58,194.31
N$45
  Bottom 0.813: R19.1 Q37.E
N$46
  Bottom 0.813: Q64.B Q60.B 59.69,189.23 arc90 58.42,190.5 R44.1 R41.2
N$47
  Top 0.813: Q34.C 108.58,118.11 arc90 109.86,116.84 116.54,116.84 arc90 119.72,120.02 | 119.72,120.02 Q39.B | 119.72,120.02 Q40.B Q40.C
N$48
  Bottom 0.813: Q41.C 125.09,130.81 arc-90 126.36,129.54 126.36,126.36 arc-90 125.09,125.09 Q40.E
N$49
  Bottom 0.813: 119.38,128.19 Q39.E | 119.38,128.19 Q42.B Q42.C | Q41.B 119.47,128.27 arc90 119.38,128.19
N$50
  Bottom 0.813: 119.38,143.56 Q46.E | 119.38,143.56 Q43.B Q43.C | Q44.B 119.43,143.51 arc-90 119.38,143.56
N$51
  Bottom 0.813: Q44.C 125.09,140.97 arc90 126.36,142.24 126.36,146.05 arc90 125.09,147.32 Q45.E
N$52
  Top 0.813: Q47.C 108.58,152.4 arc-90 109.86,153.67 118.11,153.67 arc-90 Q46.B Q45.B Q45.C
N$53
  Top 0.813: R25.1 arc-90 113.67,129.54 113.67,148.59 arc-90 R26.1
  Bottom 0.813: Q48.C Q48.B Q47.B 113.03,151.76 arc-90 R26.1
N$54
  Top 0.813: Q49.C 100.97,154.94 arc90 102.23,153.67 104.78,153.67 arc90 106.05,154.94 Q48.E
N$55
  Bottom 0.813: Q49.B Q50.B | Q47.E Q50.B | Q50.B Q50.C
N$56
  Bottom 0.813: Q55.B Q52.B Q51.B | Q51.B Q51.C | Q46.C 118.75,149.86 arc-90 116.2,147.32 Q51.B
N$57
  Top 0.813: Q53.C 100.97,148.59 arc-90 102.23,149.86 104.78,149.86 arc-90 106.05,148.59 Q51.E
N$58
  Bottom 0.813: Q49.E R20.2
N$59
  Bottom 0.813: Q50.E R21.2
N$60
  Bottom 0.813: Q53.E R22.2
N$61
  Bottom 0.813: R23.2 Q54.E
N$62
  Bottom 0.813: R24.2 Q56.E
N$63
  Top 0.813: C7.1 29.21,176.53 arc90 27.94,175.26 27.94,161.29 arc90 29.21,160.02 IC1.1
  Bottom 0.813: C7.1 R47.2
N$64
  Bottom 0.813: Q56.B Q55.E | Q56.B Q56.C | 103.5,143.15 Q53.B | 103.5,143.15 Q54.B | Q54.B Q56.B | Q54.C 103.23,142.88 arc90 103.5,143.15 | Q54.B Q52.E
N$65
  Top 0.813: R27.2 arc-90 89.53,105.41 +I1.TP
  Bottom 0.813: SJ2.2 R27.2
N$66
  Top 0.813: -I1.TP arc-90 128.91,107.95 89.53,107.95 arc-90 R28.2
  Bottom 0.813: SJ1.1 R28.2
N$67
  Bottom 0.813: Q62.3 R36.1
N$68
  Bottom 0.813: Q59.3 R34.1
N$69
  Bottom 0.813: K1.8 72.39,189.87 arc90 71.75,190.5 R67.1
N$70
  Bottom 0.813: Q58.3 R33.2
N$71
  Bottom 0.813: Q61.3 R35.2
N$72
  Top 0.813: IC1.2 30.48,162.56 arc-90 29.21,163.83 29.21,170.18 arc-90 30.48,171.45 C7.2
  Bottom 0.813: C7.2 arc-90 30.48,172.72 30.48,182.88 arc-90 R46.1
N$73
  Top 0.813: Q58.2 Q61.2 Q62.2 Q59.2 49.53,190.5 arc-90 C23.1 arc-90 53.34,194.31 R65.2
N$74
  Bottom 0.813: Q63.E Q61.1
N$75
  Top 0.813: R47.1 24.13,170.18 arc-90 22.86,168.91 arc90 21.59,167.64 C17.2
  Bottom 0.813: C17.2 arc-90 22.86,167.64 IC1.5
N$76
  Bottom 0.813: Q58.1 Q57.E
N$77
  Bottom 0.813: Q64.E Q62.1
N$78
  Bottom 0.813: Q60.E Q59.1
N$79
  Bottom 0.813: IC1.7 arc-90 25.4,161.29 25.4,152.35 | 25.4,152.35 25.4,150.68 arc-90 24.59,149.86 21.59,149.86 arc90 20.32,148.59 R48.1 | R49.2 25.35,152.4 arc-90 25.4,152.35
N$80
  Bottom 0.813: IC1.6 arc90 20.32,161.29 R48.2
N$81
  Bottom 0.813: R54.1 R57.2 93.98,168.91 arc-90 92.71,170.18 Q65.B Q71.B
N$82
  Bottom 0.813: R55.2 R58.1 93.98,190.5 arc90 92.71,189.23 Q72.B Q68.B
N$83
  Bottom 0.813: R54.2 R50.1 R52.1 R51.2 R53.2 R55.1 R56.1 111.76,198.12 J2.2 R66.1
N$84
  Top 0.813: Q66.2 Q69.2 Q67.2 Q70.2 102.87,190.5 arc90 C24.1 arc90 R64.2
N$85
  Bottom 0.813: R53.1 Q70.3
N$86
  Bottom 0.813: Q67.3 R51.1
N$87
  Bottom 0.813: Q69.1 Q71.E
N$88
  Bottom 0.813: Q72.E Q70.1
N$89
  Bottom 0.813: Q67.1 Q68.E
N$90
  Bottom 0.813: R52.2 Q69.3
N$91
  Bottom 0.813: Q66.3 R50.2
N$92
  Bottom 0.813: Q66.1 Q65.E
N$93
  Top 0.813: IC2.7 123.19,162.56 arc90 124.46,163.83 124.46,175.26 arc90 123.19,176.53 121.01,176.53 | 121.01,176.53 C21.1 | R61.2 120.65,176.89 arc90 121.01,176.53
N$94
  Top 0.813: IC2.6 121.92,165.1 arc90 123.19,166.37 123.19,170.18 arc90 121.92,171.45 C21.2
  Bottom 0.813: R60.1 121.92,184.15 arc-90 123.19,182.88 123.19,175.26 arc-67 C21.2
N$95
  Top 0.813: R32.2 118.11,166.37 arc90 119.38,167.64 119.38,190.5 arc-90 C20.2
  Bottom 0.813: J2.1 119.38,198.12 arc-90 120.65,196.85 C20.2 R59.2 123.19,187.96 arc-90 124.46,186.69 124.46,172.72 arc-74 IC2.5
N$96
  Bottom 0.813: K1.9 80.01,189.87 arc-90 81.28,190.5 R68.1
N$97
  Top 0.813: IC2.3 127,165.1 arc-90 125.73,166.37 125.73,179.07 arc-90 127,180.34 R61.1
  Bottom 0.813: IC2.3 130.81,165.1 arc-90 C22.2
N$98
  Bottom 0.813: IC2.1 R63.2 128.27,151.13 arc90 129.54,149.86 130.81,149.86 arc-90 132.08,148.59 R62.1
N$99
  Bottom 0.813: R62.2 132.08,158.75 arc90 IC2.2
N$101
  Bottom 0.813: R66.2 VO+.TP VO+1.TP
N$102
  Top 0.813: R64.1 R69.2 arc90 85.71,194.33 83.82,194.33 | K1.11 80.01,184.15 arc-90 81.28,185.42 82.55,185.42 arc90 83.82,186.69 83.82,194.33 | O+.TP arc90 83.82,196.85 83.82,194.33
N$103
  Bottom 0.813: R29.2 VO-.TP VO-1.TP
N$105
  Bottom 0.813: C28.- IC2.4 arc67 125.73,163.83 125.73,158.75 arc-90 124.46,157.48 116.84,157.48 arc-90 115.57,158.75 arc90 114.3,160.02 R71.2
N$106
  Bottom 0.813: R72.2 95.89,163.19 arc90 97.16,161.93 116.2,161.93 arc-90 C27.+ arc90 118.11,160.02 IC2.8
N$107
  Top 0.813: IC1.8 25.4,160.02 arc90 26.04,160.66 C25.+
  Bottom 0.813: C25.+ arc-90 26.67,170.81 26.67,163.83 arc90 27.94,162.56 arc-90 29.21,161.29 29.21,160.02 arc90 30.48,158.75 35.56,158.75 36.83,160.02 R38.1
N$108
  Bottom 0.813: R37.2 54.61,163.83 53.34,162.56 37.47,162.56 C26.- arc90 33.02,167.64 IC1.4
N$109  (via drill 0.35)
  Top 0.813: 63.5,163.83 R37.1 | 63.5,163.83 64.77,162.56 v64.77,158.75 | 63.5,163.83 arc-90 66.04,161.29 66.04,101.6 arc90 67.31,100.33 R73.2
  Bottom 0.813: R71.1 66.04,160.02 v64.77,158.75 | R73.2 73.66,100.33 arc-90 74.93,99.06 74.93,90.17 arc-90 73.66,88.9 63.5,88.9 arc90 62.23,87.63 C30.-
N$110
  Top 0.813: C29.+ 87.63,85.09 arc-90 86.36,86.36 86.36,161.93 arc-90 R72.1
  Bottom 0.813: R38.2 62.87,160.66 63.5,161.29 85.72,161.29 R72.1 | R74.2 80.01,92.71 arc90 81.28,91.44 85.09,91.44 arc-90 86.36,90.17 86.36,86.36 arc90 87.63,85.09 C29.+
V+
  Top 0.813: R15.2 R16.2 R17.2 R18.2 R19.2 | Q63.C Q57.C 57.15,170.18 arc90 58.42,168.91 R43.1 | R1.2 R2.2 R3.2 R4.2 R5.2 | Q71.C Q65.C 95.25,170.18 arc-90 93.98,168.91 R57.1 | R74.1 73.66,96.52 arc90 74.93,97.79 74.93,116.84 arc90 73.66,118.11 arc90 C14.+ 71.6,118.26 arc-90 70.48,119.38 70.48,161.29 arc64 67.31,166.37 arc-75 66.04,168.91 arc59 64.77,172.72 arc84 C8.1
  Bottom 0.813: R43.1 62.23,171.45 arc-90 C8.1 71.12,180.34 81.28,180.34 C18.1 arc-90 90.17,171.45 R57.1 | 83.19,127 C10.1 C11.1 | C4.1 83.19,127 | C11.1 62.87,127 R4.2 | 83.19,127 88.27,127 R18.2 | C11.1 73.03,118.75 arc90 C14.+
V-
  Top 0.813: R24.1 R23.1 R22.1 R21.1 R20.1 | Q64.C Q60.C 57.15,189.23 arc-90 58.42,190.5 R44.2 | R10.1 R9.1 R8.1 R7.1 R6.1 | Q68.C Q72.C 95.25,189.23 arc90 93.98,190.5 R58.2 | R73.1 arc90 81.28,101.6 81.28,111.74 81.38,111.84 81.38,113.91 81.28,114.01 81.28,146.05 arc90 C15.- 79.86,148.44 arc90 83.82,152.4 83.82,163.83 arc-90 85.09,165.1 arc90 86.36,166.37 86.36,184.15 arc-53 87.63,186.69 C19.2
  Bottom 0.813: R58.2 90.17,187.96 arc-90 C19.2 arc-90 87.63,185.42 64.77,185.42 arc-90 C9.2 arc-90 62.23,187.96 R44.2 | R24.1 C12.2 | C12.2 78.74,148.28 arc-90 C15.- | C12.2 C13.2 68.73,139.7 | 68.73,139.7 R10.1 | C5.2 68.58,139.55 arc-90 68.73,139.7